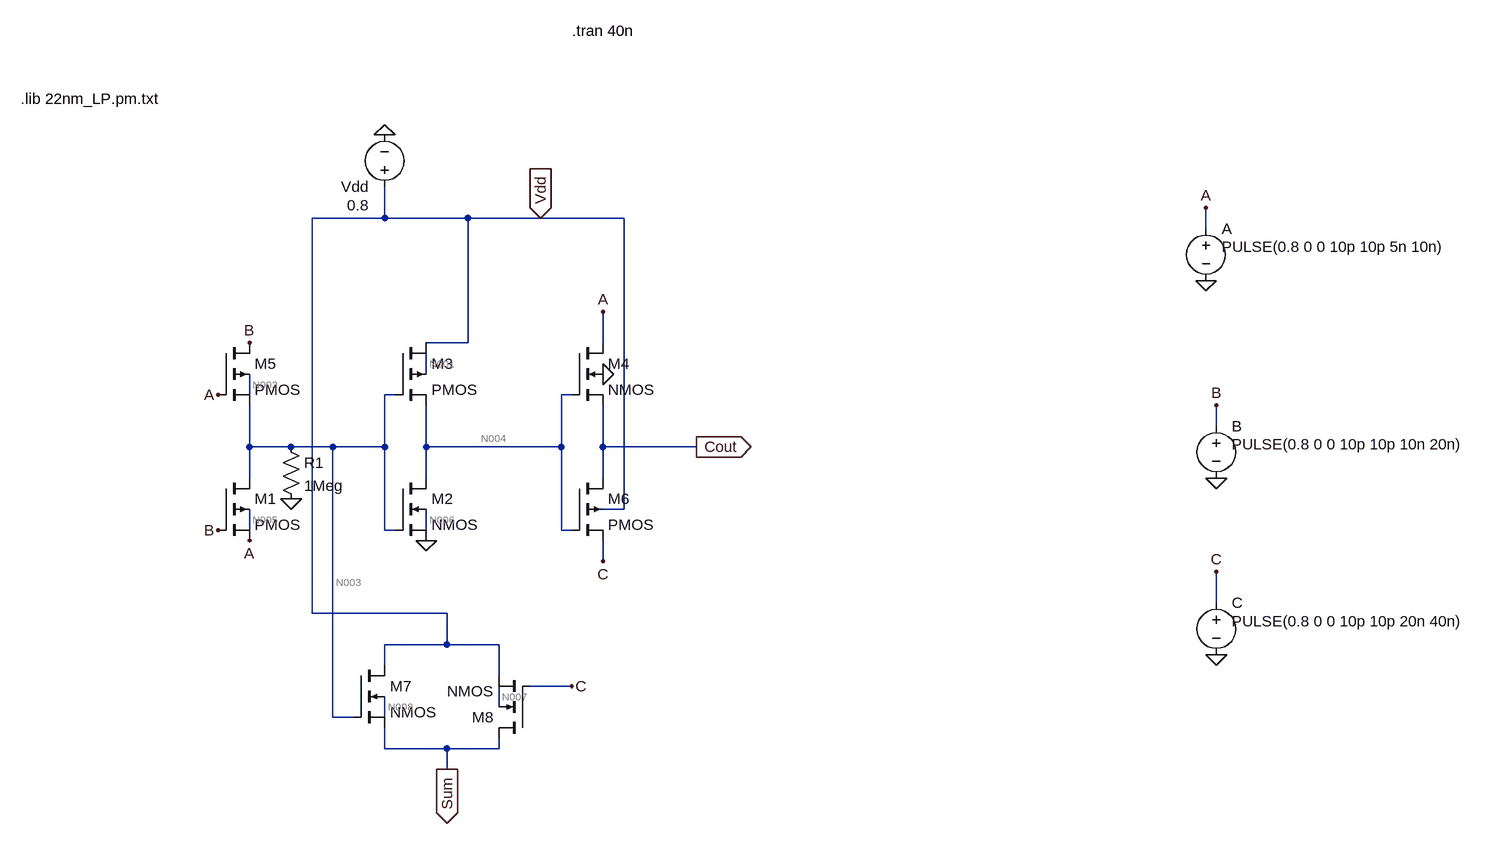
[diagram p0: schematic InXA2_22nm.asc]
InXA2_22nm.asc, the LTspice schematic file:
Version 4
SHEET 1 1044 720
WIRE -640 -240 -640 -288
WIRE -640 -240 -752 -240
WIRE -512 -240 -640 -240
WIRE -400 -240 -512 -240
WIRE -272 -240 -400 -240
WIRE 624 -224 624 -256
WIRE -512 -48 -512 -240
WIRE -512 -48 -576 -48
WIRE -304 -48 -304 -96
WIRE -576 0 -576 -32
WIRE -848 32 -848 0
WIRE -624 32 -640 32
WIRE -352 32 -368 32
WIRE 640 80 640 48
WIRE -848 112 -848 48
WIRE -784 112 -848 112
WIRE -720 112 -784 112
WIRE -640 112 -640 32
WIRE -640 112 -720 112
WIRE -576 112 -576 48
WIRE -368 112 -368 32
WIRE -368 112 -576 112
WIRE -304 112 -304 48
WIRE -160 112 -304 112
WIRE -848 160 -848 112
WIRE -576 160 -576 112
WIRE -304 160 -304 112
WIRE -272 208 -272 -240
WIRE -272 208 -304 208
WIRE -848 240 -848 208
WIRE -640 240 -640 112
WIRE -624 240 -640 240
WIRE -576 240 -576 208
WIRE -368 240 -368 112
WIRE -352 240 -368 240
WIRE -304 288 -304 256
WIRE 640 352 640 304
WIRE -752 368 -752 -240
WIRE -544 368 -752 368
WIRE -544 416 -544 368
WIRE -544 416 -640 416
WIRE -464 416 -544 416
WIRE -640 448 -640 416
WIRE -464 464 -464 416
WIRE -352 480 -416 480
WIRE -464 512 -464 480
WIRE -720 528 -720 112
WIRE -688 528 -720 528
WIRE -640 528 -640 496
WIRE -640 576 -640 544
WIRE -544 576 -640 576
WIRE -464 576 -464 560
WIRE -464 576 -544 576
WIRE -544 608 -544 576
FLAG 624 -144 0
FLAG 640 160 0
FLAG 640 432 0
FLAG 624 -256 A
FLAG 640 48 B
FLAG 640 304 C
FLAG -400 -240 Vdd
IOPIN -400 -240 In
FLAG -640 -368 0
FLAG -896 32 A
FLAG -848 256 A
FLAG -896 240 B
FLAG -848 -48 B
FLAG -576 256 0
FLAG -304 0 0
FLAG -304 -96 A
FLAG -304 288 C
FLAG -160 112 Cout
IOPIN -160 112 Out
FLAG -544 608 Sum
IOPIN -544 608 Out
FLAG -352 480 C
FLAG -784 192 0
SYMBOL voltage 624 -240 R0
WINDOW 3 24 44 Left 2
WINDOW 123 0 0 Left 0
WINDOW 39 0 0 Left 0
SYMATTR Value PULSE(0.8 0 0 10p 10p 5n 10n)
SYMATTR InstName A
SYMBOL voltage 640 64 R0
WINDOW 3 24 44 Left 2
WINDOW 123 0 0 Left 0
WINDOW 39 0 0 Left 0
SYMATTR Value PULSE(0.8 0 0 10p 10p 10n 20n)
SYMATTR InstName B
SYMBOL voltage 640 336 R0
WINDOW 3 24 44 Left 2
WINDOW 123 0 0 Left 0
WINDOW 39 0 0 Left 0
SYMATTR Value PULSE(0.8 0 0 10p 10p 20n 40n)
SYMATTR InstName C
SYMBOL voltage -640 -272 R180
WINDOW 3 24 -12 Left 2
WINDOW 123 0 0 Left 0
WINDOW 39 0 0 Left 0
SYMATTR Value 0.8
SYMATTR InstName Vdd
SYMBOL nmos4 -624 160 R0
SYMATTR InstName M2
SYMATTR Value2 l=22n w=44n
SYMBOL pmos4 -896 -48 R0
SYMATTR InstName M5
SYMATTR Value2 l=22n w=88n
SYMBOL res -800 96 R0
SYMATTR InstName R1
SYMATTR Value 1Meg
SYMBOL pmos4 -896 160 R0
SYMATTR InstName M1
SYMATTR Value2 l=22n w=88n
SYMBOL pmos4 -624 -48 R0
SYMATTR InstName M3
SYMATTR Value2 l=22n w=88n
SYMBOL pmos4 -352 160 R0
SYMATTR InstName M6
SYMATTR Value2 l=22n w=88n
SYMBOL nmos4 -352 -48 R0
SYMATTR InstName M4
SYMATTR Value2 l=22n w=44n
SYMBOL nmos4 -688 448 R0
SYMATTR InstName M7
SYMATTR Value2 l=22n w=44n
SYMBOL nmos4 -416 560 R180
SYMATTR InstName M8
SYMATTR Value2 l=22n w=44n
TEXT -1200 -424 Left 2 !.lib 22nm_LP.pm.txt
TEXT -352 -528 Left 2 !.tran 40n

The netlist it stands for:
* InXA2_22nm.asc
V§A A 0 PULSE(0.8 0 0 10p 10p 5n 10n)
V§B B 0 PULSE(0.8 0 0 10p 10p 10n 20n)
V§C C 0 PULSE(0.8 0 0 10p 10p 20n 40n)
Vdd Vdd 0 0.8
M2 N004 N003 0 N006 NMOS l=22n w=44n
M5 B A N003 N002 PMOS l=22n w=88n
R1 N003 0 1Meg
M1 N003 B A N005 PMOS l=22n w=88n
M3 Vdd N003 N004 N001 PMOS l=22n w=88n
M6 Cout N004 C Vdd PMOS l=22n w=88n
M4 A N004 Cout 0 NMOS l=22n w=44n
M7 Vdd N003 Sum N008 NMOS l=22n w=44n
M8 Sum C Vdd N007 NMOS l=22n w=44n
.model NMOS NMOS
.model PMOS PMOS
.lib standard.mos
.lib 22nm_LP.pm.txt
.tran 40n
.backanno
.end

* Results of the author's LTspice run, read from the files saved beside the schematic
* Operating Point, zero values left out:
*   V(a) = 800 mV
*   V(b) = 800 mV
*   V(c) = 800 mV
*   V(vdd) = 800 mV
*   V(n004) = 799.7 mV
*   V(n003) = 48 mV
*   V(n006) = 247.2 mV
*   V(n002) = 676.4 mV
*   V(n005) = 510.8 mV
*   V(n001) = 688 mV
*   V(cout) = 798.7 mV
*   V(sum) = 774.4 mV
*   V(n008) = 527.9 mV
*   V(n007) = 528.2 mV
*   Id(M3) = 59.21 nA
*   Is(M3) = -59.21 nA
*   Id(M1) = -35.08 nA
*   Is(M1) = 35.08 nA
*   Id(M5) = 12.9 nA
*   Is(M5) = -12.9 nA
*   Id(M8) = -6.895 pA
*   Is(M8) = 7.415 pA
*   Id(M7) = 7.736 pA
*   Ig(M7) = -14.1 pA
*   Is(M7) = 6.895 pA
*   Ib(M4) = -1.613 pA
*   Id(M2) = 59.21 nA
*   Ig(M2) = -7.431 pA
*   Is(M2) = -59.2 nA
*   I(R1) = 48 nA
*   I(Vdd) = -59.23 nA
*   I(B) = -12.9 nA
*   I(A) = -35.08 nA
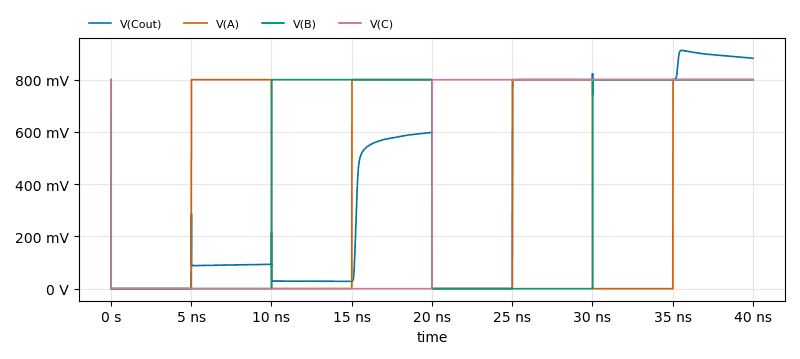
[diagram p1: Transient Analysis of InXA2_22nm.asc, plotted from the saved traces]
* Transient Analysis, 1 run:
*   V(Cout): min -622.6 µV, max 912.2 mV, average 393.5 mV, rms 546 mV, last 882 mV
*   V(A): min 0 V, max 800 mV, average 399.2 mV, rms 565 mV, last 800 mV
*   V(B): min 0 V, max 800 mV, average 399.6 mV, rms 565.3 mV, last 800 mV
*   V(C): min 0 V, max 800 mV, average 399.8 mV, rms 565.5 mV, last 800 mV